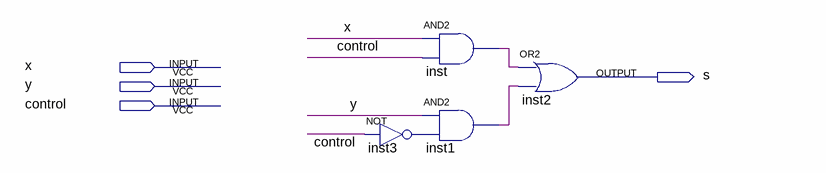
[diagram p0: schematic sheet]
// Quartus schematic mux2.bdf as structural Verilog: 4 symbols, 4 pins
module mux2 (
  input  x,
  input  y,
  input  control,
  output s
);

  wire inst1_out, inst3_out, inst_out;

  not inst3 (inst3_out, control);
  and inst (inst_out, x, control);
  and inst1 (inst1_out, y, inst3_out);
  or inst2 (s, inst_out, inst1_out);
endmodule
